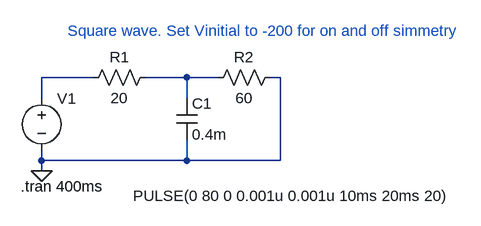
[diagram p0: schematic RC-square-wave-response.asc]
RC-square-wave-response.asc, the LTspice schematic file:
Version 4
SHEET 1 1076 680
WIRE 160 80 80 80
WIRE 304 80 240 80
WIRE 352 80 304 80
WIRE 448 80 432 80
WIRE 80 112 80 80
WIRE 304 112 304 80
WIRE 80 208 80 192
WIRE 304 208 304 176
WIRE 304 208 80 208
WIRE 448 208 448 80
WIRE 448 208 304 208
WIRE 80 224 80 208
FLAG 80 224 0
SYMBOL voltage 80 96 R0
WINDOW 123 0 0 Left 2
WINDOW 39 0 0 Left 2
WINDOW 3 141 166 Left 2
SYMATTR InstName V1
SYMATTR Value PULSE(0 80 0 0.001u 0.001u 10ms 20ms 20)
SYMBOL res 256 64 R90
WINDOW 0 0 56 VBottom 2
WINDOW 3 32 56 VTop 2
SYMATTR InstName R1
SYMATTR Value 20
SYMBOL res 448 64 R90
WINDOW 0 0 56 VBottom 2
WINDOW 3 32 56 VTop 2
SYMATTR InstName R2
SYMATTR Value 60
SYMBOL cap 288 112 R0
SYMATTR InstName C1
SYMATTR Value 0.4m
TEXT 48 248 Left 2 !.tran 400ms
TEXT 120 8 Left 2 ;Square wave. Set Vinitial to -200 for on and off simmetry

The netlist it stands for:
* RC-square-wave-response.asc
V1 N001 0 PULSE(0 80 0 0.001u 0.001u 10ms 20ms 20)
R1 N002 N001 20
R2 0 N002 60
C1 N002 0 0.4m
.tran 400ms
* Square wave. Set Vinitial to -200 for on and off simmetry
.backanno
.end